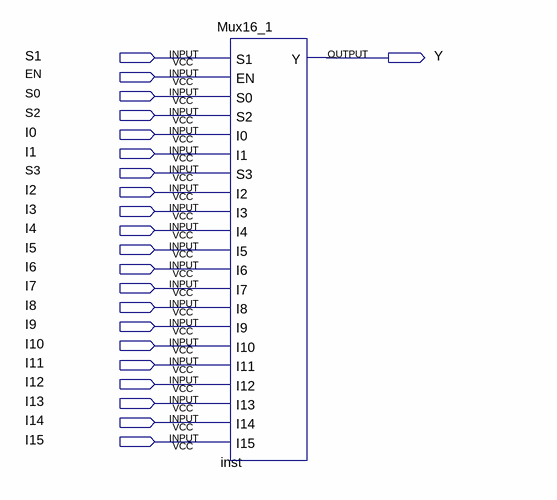
[diagram p0: schematic sheet]
// Quartus schematic MuxDemo16_1.bdf as structural Verilog: 1 symbols, 22 pins
module MuxDemo16_1 (
  input  S1,
  input  EN,
  input  S0,
  input  S2,
  input  I0,
  input  I1,
  input  S3,
  input  I2,
  input  I3,
  input  I4,
  input  I5,
  input  I6,
  input  I7,
  input  I8,
  input  I9,
  input  I10,
  input  I11,
  input  I12,
  input  I13,
  input  I14,
  input  I15,
  output Y
);

  Mux16_1 inst (.Y(Y));  // open: S1, EN, S0, S2, I0, I1, S3, I2, I3, I4, I5, I6, I7, I8, I9, I10, I11, I12, I13, I14, I15
endmodule
